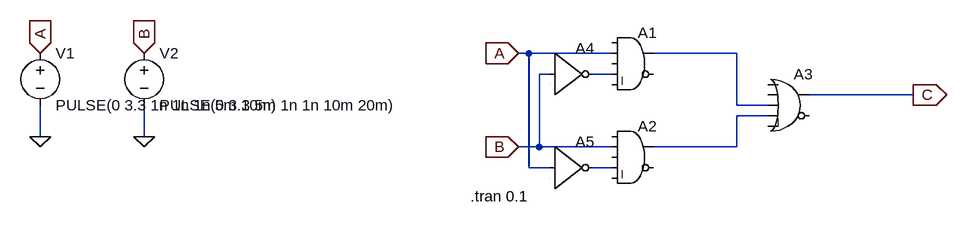
[diagram p0: schematic xor.asc]
xor.asc, the LTspice schematic file:
Version 4
SHEET 1 880 680
WIRE -48 80 -64 80
WIRE 80 80 -48 80
WIRE 272 80 144 80
WIRE -16 112 -32 112
WIRE 80 112 48 112
WIRE 544 144 384 144
WIRE 272 160 272 80
WIRE 320 160 272 160
WIRE 320 176 272 176
WIRE -800 208 -800 160
WIRE -640 208 -640 160
WIRE -32 224 -32 112
WIRE -32 224 -64 224
WIRE 80 224 -32 224
WIRE 272 224 272 176
WIRE 272 224 144 224
WIRE -48 256 -48 80
WIRE -16 256 -48 256
WIRE 80 256 48 256
FLAG -64 80 A
IOPIN -64 80 In
FLAG 544 144 C
IOPIN 544 144 Out
FLAG -64 224 B
IOPIN -64 224 In
FLAG -800 208 0
FLAG -640 208 0
FLAG -800 80 A
IOPIN -800 80 In
FLAG -640 80 B
IOPIN -640 80 In
SYMBOL Digital\\and 112 32 R0
SYMATTR InstName A1
SYMBOL Digital\\and 112 176 R0
SYMATTR InstName A2
SYMBOL Digital\\or 352 96 R0
SYMATTR InstName A3
SYMBOL Digital\\inv -16 48 R0
SYMATTR InstName A4
SYMBOL Digital\\inv -16 192 R0
SYMATTR InstName A5
SYMBOL voltage -800 64 R0
WINDOW 123 0 0 Left 0
WINDOW 39 0 0 Left 0
SYMATTR InstName V1
SYMATTR Value PULSE(0 3.3 1n 1n 1n 5m 10m)
SYMBOL voltage -640 64 R0
WINDOW 123 0 0 Left 0
WINDOW 39 0 0 Left 0
SYMATTR InstName V2
SYMATTR Value PULSE(0 3.3 5m 1n 1n 10m 20m)
TEXT -138 300 Left 2 !.tran 0.1

The netlist it stands for:
* xor.asc
A1 0 A 0 N002 0 0 N001 0 AND
A2 0 B 0 N004 0 0 N003 0 AND
A3 0 0 N001 N003 0 0 C 0 OR
A4 B 0 0 0 0 N002 0 0 BUF
A5 A 0 0 0 0 N004 0 0 BUF
V1 A 0 PULSE(0 3.3 1n 1n 1n 5m 10m)
V2 B 0 PULSE(0 3.3 5m 1n 1n 10m 20m)
.tran 0.1
.backanno
.end